# EAGLE schematic sampledelay (EAGLE 9.4.2)
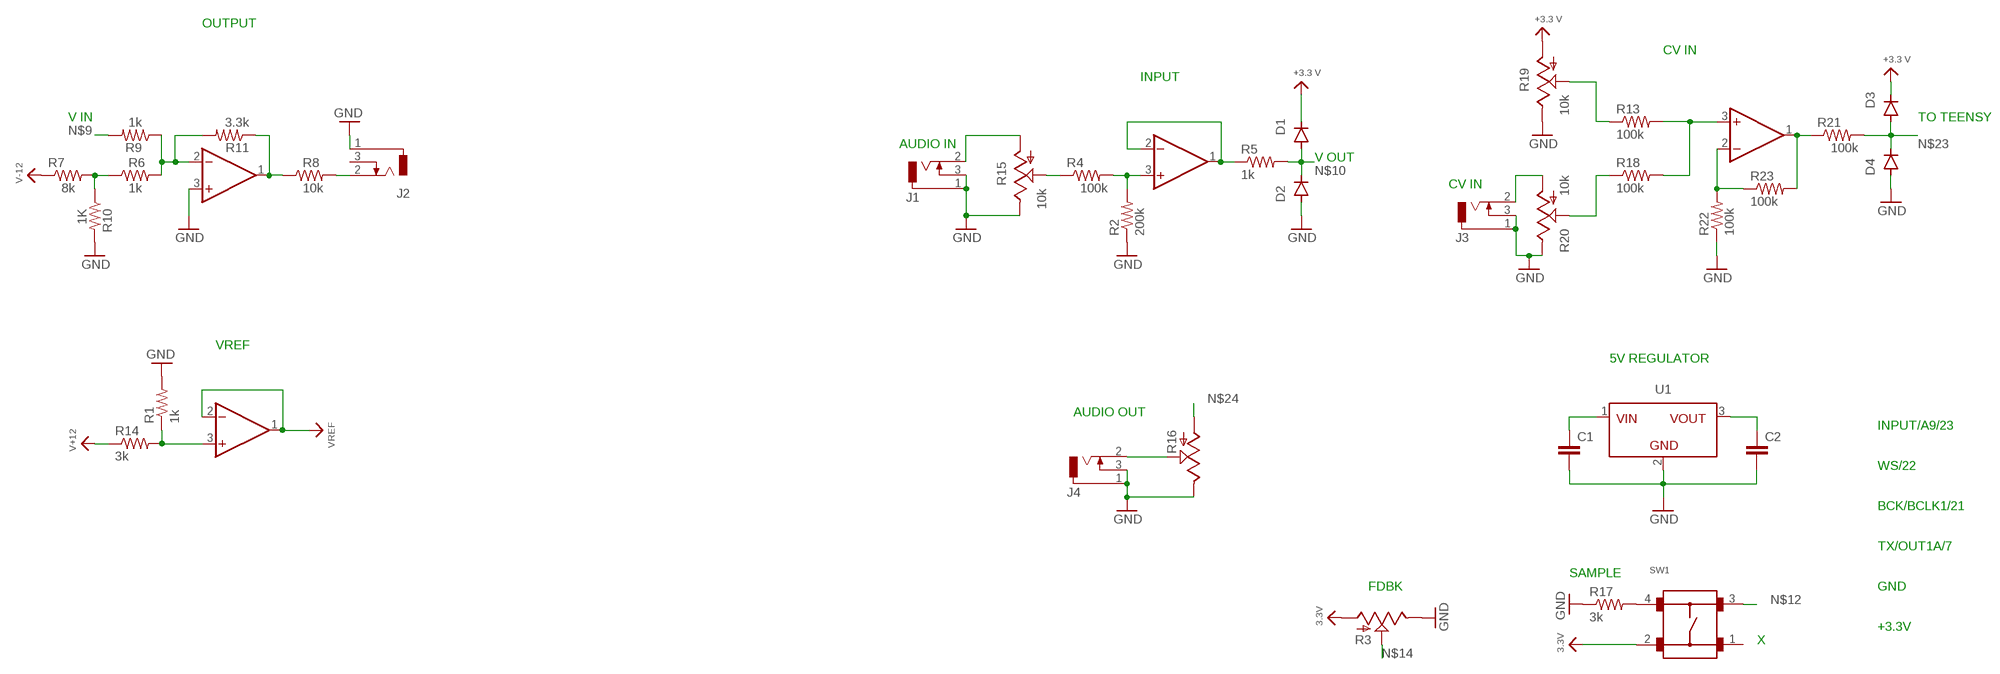
[diagram p0: schematic, sheet 1]

## Parts
C1  C10/5  [C10B5]
C2  C10/5  [C10B5]
D1  1N4148DO35-7  [DO35-7]
D2  1N4148DO35-7  [DO35-7]
D3  1N4148DO35-7  [DO35-7]
D4  1N4148DO35-7  [DO35-7]
IC1  LMV358  LMV358SOIC  [SO08]
IC2  LMV358  LMV358SOIC  [SO08]
IC3  LMV358  LMV358SOIC  [SO08]
IC4  LMV358  LMV358SOIC  [SO08]
J1  PJRAN1X1U01X  [PJRAN1X1U01X]
J2  PJRAN1X1U01X  [PJRAN1X1U01X]
J3  PJRAN1X1U01X  [PJRAN1X1U01X]
J4  PJRAN1X1U01X  [PJRAN1X1U01X]
R1  1k  R-US_0613/15  [P0613/15]
R2  200k  R-US_0613/15  [P0613/15]
R3  TRIM_US-3223G  [3223G]
R4  100k  R-US_0613/15  [P0613/15]
R5  1k  R-US_0613/15  [P0613/15]
R6  1k  R-US_0613/15  [P0613/15]
R7  8k  R-US_0613/15  [P0613/15]
R8  10k  R-US_0613/15  [P0613/15]
R9  1k  R-US_0613/15  [P0613/15]
R10  1K  R-US_0613/15  [P0613/15]
R11  3.3k  R-US_0613/15  [P0613/15]
R13  100k  R-US_0613/15  [P0613/15]
R14  3k  R-US_0613/15  [P0613/15]
R15  10k  TRIM_US-3223G  [3223G]
R16  TRIM_US-3223G  [3223G]
R17  3k  R-US_0613/15  [P0613/15]
R18  100k  R-US_0613/15  [P0613/15]
R19  10k  TRIM_US-3223G  [3223G]
R20  10k  TRIM_US-3223G  [3223G]
R21  100k  R-US_0613/15  [P0613/15]
R22  100k  R-US_0613/15  [P0613/15]
R23  100k  R-US_0613/15  [P0613/15]
SW1  B3F-1000  [B3F-1000]
U1  FDSM_SIP-3_173010542  [FDSM-173XXXX42]

## Nets
GND: C1.2 C2.2 D2.A D4.A IC2.3(+IN) J1.1 J1.3 J2.1 J3.1 J3.3 J4.1 J4.3 R1.2 R2.1 R3.3(E) R10.2 R15.3(E) R16.3(E) R17.1 R19.3(E) R20.3(E) R22.1 U1.2(GND)
N$1: IC1.3(+IN) R2.2 R4.2
N$2: IC1.1(OUT) IC1.2(-IN) R5.1
N$3: R17.2 SW1.4
N$4: R4.1 R15.2(S)
N$5: IC2.2(-IN) R6.2 R9.1 R11.2
N$6: R6.1 R7.2 R10.1
N$7: J2.2 R8.2
N$8: IC2.1(OUT) R8.1 R11.1
N$9: R9.2
N$10: D1.A D2.C R5.2
N$11: IC4.1(OUT) R21.1 R23.2
N$12: SW1.3
N$13: IC3.3(+IN) R1.1 R14.2
N$14: R3.2(S)
N$15: J4.2 R16.2(S)
N$16: J1.2 R15.1(A)
N$17: C1.1 U1.1(VIN)
N$18: C2.1 U1.3(VOUT)
N$19: IC4.3(+IN) R13.2 R18.2
N$20: R13.1 R19.2(S)
N$21: R18.1 R20.2(S)
N$22: J3.2 R20.1(A)
N$23: D3.A D4.C R21.2
N$24: R16.1(A)
N$25: IC4.2(-IN) R22.2 R23.1
VCC: D1.C D3.C IC3.1(OUT) IC3.2(-IN) R3.1(A) R7.1 R14.1 R19.1(A) SW1.2 ; supply symbol labelled V-12, V+12, VREF, 3.3V, +3.3 V
Unconnected: IC1.4(P$V-) IC1.5(+IN) IC1.6(-IN) IC1.7(OUT) IC1.8(P$V+) IC2.4(P$V-) IC2.5(+IN) IC2.6(-IN) IC2.7(OUT) IC2.8(P$V+) IC3.4(P$V-) IC3.5(+IN) IC3.6(-IN) IC3.7(OUT) IC3.8(P$V+) IC4.4(P$V-) IC4.5(+IN) IC4.6(-IN) IC4.7(OUT) IC4.8(P$V+) J2.3 SW1.1

## Notes on the sheet
- OUTPUT
- CV IN
- INPUT
- V IN | TO TEENSY
- AUDIO IN
- V OUT
- CV IN
- VREF
- 5V REGULATOR
- AUDIO OUT
- INPUT/A9/23
- WS/22
- BCK/BCLK1/21
- TX/OUT1A/7
- SAMPLE
- FDBK | GND
- +3.3V
- X

## Library data of the parts
C1 C2 = capacitor-wima:C: CAPACITOR naming: grid - package width
D1-D4 = diode:1N4148: DIODE high speed (Philips)
IC1-IC4 = SparkFun-IC-Amplifiers:LMV358: IC LMV358 DUAL OP AMP Jellybean rail-to-rail output op-amp SparkFun Products SparkFun PicoBoard <https://www.sparkfun.com/products/11888> (WIG-11888) SparkFun Vernier Interface Shield <https://www.sparkfun.com/products/12858> (DEV-12858) SparkFun Blynk Board - ESP8266 <https://www.sparkfun.com/products/13794> (WRL-13794) SparkFun Digital Sandbox <https://www.sparkfun.com/products/12651> (DEV-12651 RoHS); PROD_ID: IC-09657
J1-J4 = Connectors:PJRAN1X1U01X: CONN RCA JACK MONO 3.2MM R/A Manufacturer's datasheet <http://www.switchcraft.com/Drawings/pjran1x1u__x_series_cd.pdf>; CREATED_BY: PCBLayout.com; DIGIKEY_PART_NUMBER: PJRAN1X1U01X-ND; MANUFACTURER: Switchcraft Inc.; MPN: PJRAN1X1U01X
R1 R2 R4-R11 R13 R14 R17 R18 R21-R23 = adafruit:R-US_: RESISTOR, American symbol
R3 R15 R16 R19 R20 = pot:TRIM_US-: POTENTIOMETER
SW1 = Switch:B3F-1000: Tactile Switch SPST-NO Top Actuated Through Hole Manufacturer's datasheet <https://omronfs.omron.com/en_US/ecb/products/pdf/en-b3f.pdf>; CREATED_BY: PCBLayout.com; DIGI_KEY_PART_NUMBER: SW400-ND; MANUFACTURER: Omron Electronics Inc-EMC Div; MPN: B3F-1000; PACKAGE: SPST-NO
U1 = Wurth_Elektronik_SemiConductors_rev19b:FDSM_SIP-3: MagI³C-FDSM Fixed Step Down Regulator Module Characteristics Simplest design (no power supply knowledge required) Leaded through-hole package for easy manufacturing and prototyping Stand alone solution (CIN and COUT integrated, no external components) L78x series linear regulator replacement (no heatsink required) Low conducted and radiated EMI (compliant to EN55022 class B) Applications Point-of-Load from 24V, 18V, 15V, 12V, 9V rail Replacement for linear regulators Interface and microcontroller supply Industrial, Test & Measurement, Medical applications System power supplies <https://katalog.we-online.com/media/images/v2/o55808v209%20FDSM_MagI3C_173010378_4C.jpg> Details see: https://katalog.we-online.com/en/pm/MAGIC_FDSM_FIXED_OUTPUT_VOLTAGE Updated by Ella Wu 2019-05-7 2019 (C) Würth Elektronik; VALUE: 8-42Vin/5Vout/1Aout; WE-NUMBER: 173010542